# EasyEDA Pro project ProDoc_Board1_2_2024-09-12 (1).epro

# Schematic Schematic1_2
Create Date: 2024-07-28; Page Name: P1; Project Name: 四足机器人; Schematic Name: Schematic1_2; Update Date: 2024-07-28
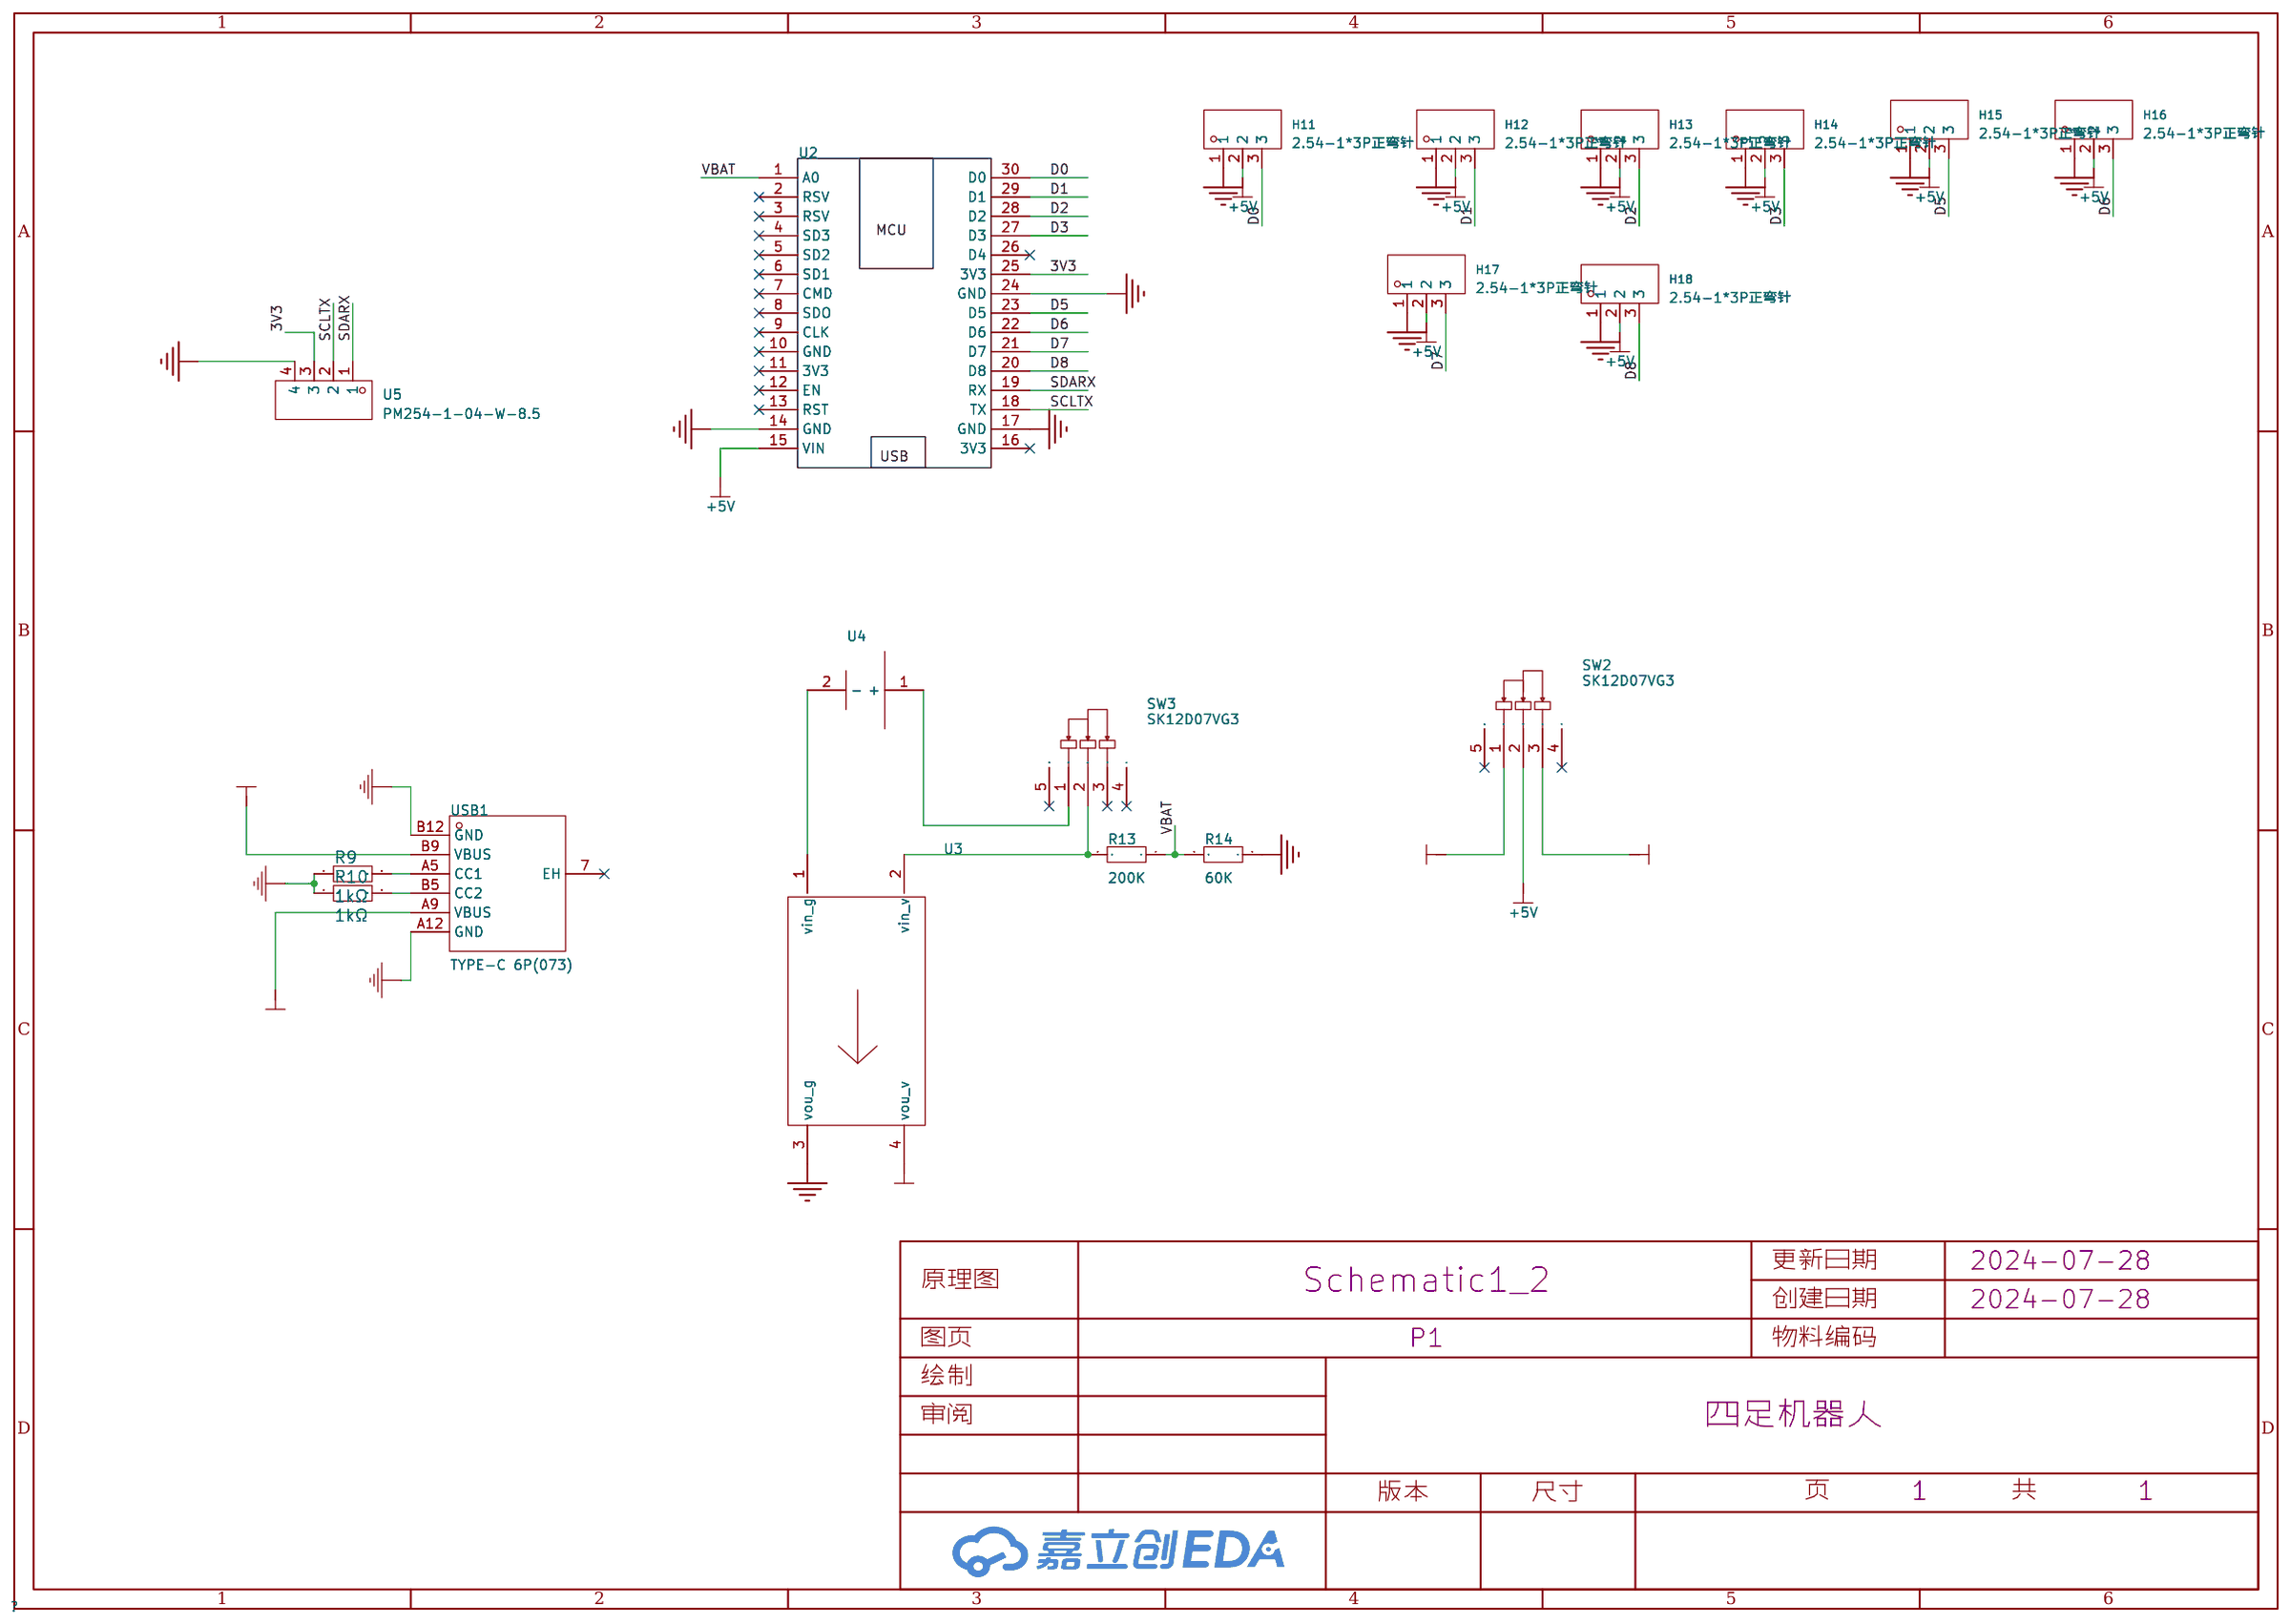
[diagram p0: schematic sheet]

## Parts
H11  2.54-1*3P正弯针  [HDR-TH_3P-P2.54-H-M-BW7.2-P]
H12  2.54-1*3P正弯针  [HDR-TH_3P-P2.54-H-M-BW7.2-P]
H13  2.54-1*3P正弯针  [HDR-TH_3P-P2.54-H-M-BW7.2-P]
H14  2.54-1*3P正弯针  [HDR-TH_3P-P2.54-H-M-BW7.2-P]
H15  2.54-1*3P正弯针  [HDR-TH_3P-P2.54-H-M-BW7.2-P]
H16  2.54-1*3P正弯针  [HDR-TH_3P-P2.54-H-M-BW7.2-P]
H17  2.54-1*3P正弯针  [HDR-TH_3P-P2.54-H-M-BW7.2-P]
H18  2.54-1*3P正弯针  [HDR-TH_3P-P2.54-H-M-BW7.2-P]
R9  1kΩ  [R0603]
R10  1kΩ  [R0603]
R13  200K  [R0603]
R14  60K  [R0603]
SW2  SK12D07VG3  [SW-TH_SK12D07VG3]
SW3  SK12D07VG3  [SW-TH_SK12D07VG3]
U2  -  [nodemcu]
U3  -  [5v5a降压模块]
U4  -  [7.4v]
U5  PM254-1-04-W-8.5  [HDR-TH_4P-P2.54-H-F-W10.0-N]
USB1  TYPE-C 6P(073)  [TYPE-C-SMD_TYPE-C-6P]

## Library data of the parts
H11-H18 = 2.54-1*3P正弯针: 插针结构:1x3P;间距:2.54mm;行距:-;圆针/方针:方针;安装类型:弯插;排数:单排;总PIN位数:3P;额定电流:3A;额定电压:-;配合针长度:3mm;塑高:2.54mm;端接针长度:-;触头材质:-;触头镀层:-;工作温度范围:-55℃~+105℃;颜色:黑色;; LCSC Part Name: 间距:2.54mm 1x3P 弯插 方针; Supplier Part: C92159; Manufacturer: BOOMELE(博穆精密); Supplier Footprint: 弯插,P=2.54mm; JLCPCB Part Class: 扩展库; Datasheet: https://atta.szlcsc.com/upload/public/pdf/source/20181121/C2334_B051029C4931EB562F9DCCAAD18AC88A.pdf; Supplier: LCSC; Pin Structure: 1x3P; Pitch: 2.54mm; Circluar Pins/Square Pins: 方针; Mounting Type: 弯插; Number of Rows: 单排; Number of Pins: 3P; Current Rating (Max): 3A; Length of Mating Pin: 3mm; Insulation Height: 2.54mm; Operating Temperature Range: -55℃~+105℃; Color: 黑色
R9 R10 R13 R14 = 0603WAF1002T5E: 阻值:10kΩ;精度:±1%;功率:100mW;温度系数:±100ppm/℃;电阻类型:厚膜电阻;; LCSC Part Name: 10kΩ ±1% 100mW 厚膜电阻; Supplier Part: C25804; Manufacturer: UNI-ROYAL(厚声); Supplier Footprint: 0603; JLCPCB Part Class: Basic Part; Datasheet: https://atta.szlcsc.com/upload/public/pdf/source/20200306/C422600_1E6D84923E4A46A82E41ADD87F860B5C.pdf; Supplier: LCSC; Tolerance: ±1%; Power(Watts): 100mW; Overload Voltage (Max): 75V; Temperature Coefficient: ±100ppm/℃; Type: 厚膜电阻; Operating Temperature Range: -55℃~+155℃
SW2 SW3 = SK12D07VG3: 电路结构:单刀双掷;安装方式:侧插;开关颜色:-;额定电流(DC):500mA;额定电压(DC):50V;额定电流(AC):-;额定电压(AC):-;机械寿命:5千次;; LCSC Part Name: 两档位卧式拨动开关,柄长3MM; Supplier Part: C431547; Manufacturer: SHOU HAN(首韩); Supplier Footprint: 插件; JLCPCB Part Class: 扩展库; Datasheet: https://atta.szlcsc.com/upload/public/pdf/source/20190925/C431547_01B93C6F3FA5C09E15F8CCBF4E6DB91A.pdf; Supplier: LCSC; Circuit: 单刀双掷; Pin Style: PC引脚; Switch Length: 8.7mm; Switch Width: 4.4mm; Switch Height: 4.7mm; Mounting Style: 侧插; Current Rating (DC): 500mA; Voltage Rating (DC): 50V; Mechanical Life: 5千次; Operating Temperature: -10℃~+50℃
U2 = nodemcu
U3 = 5v5a降压模块
U4 = 7.4电池输入口
U5 = PM254-1-04-W-8.5: 插孔结构:1x4P;间距:2.54mm;行距:-;圆孔/方孔:方孔;安装类型:弯插;排数:单排;总孔位数:4P;额定电流:3A;额定电压:-;插孔方向:侧面;塑高:8.5mm;触头材质:铜合金;工作温度范围:-40℃~+105℃;焊接温度(最大值):260℃@5S;; LCSC Part Name: 1x4P 间距:2.54mm 弯插; Supplier Part: C2897386; Manufacturer: HCTL(华灿天禄); Supplier Footprint: 弯插,P=2.54mm; JLCPCB Part Class: 扩展库; Datasheet: https://atta.szlcsc.com/upload/public/pdf/source/20230609/7BA40A3D721268A082DCDEAD4C99131B.pdf; Supplier: LCSC; Holes Structure: 1x4P; Pitch: 2.54mm; Circular Hole / Square Hole: 方孔; Mounting Type: 弯插; Number of Rows: 单排; Number of Holes: 4P; Current Rating (Max): 3A; Holes Direction: 侧面; Insulation Height: 8.5mm; Contact Material: 铜合金; Operating Temperature Range: -40℃~+105℃; Soldering Temperature(Max): 260℃@5S
USB1 = TYPE-C 6P(073): 连接器类型:Type-C;标准:-;公母:母;端口数量:1;触点数量:6P;安装方式:卧贴;额定电流 - 电源:5A;工作温度范围:-25℃~+85℃;; LCSC Part Name: Type-C 母 卧贴; Supplier Part: C668623; Manufacturer: SHOU HAN(首韩); Supplier Footprint: SMD; JLCPCB Part Class: 扩展库; Datasheet: https://atta.szlcsc.com/upload/public/pdf/source/20200618/C668623_A4B260DED7AC1949BAC6AE39E9F4CD80.pdf; Supplier: LCSC; Connector Type: Type-C; Gender: 母; Number of Ports: 1; Number of Contacts: 6P; Mounting Style: 卧贴; Current Rating - Power (Max): 5A; Operating Temperature Range: -25℃~+85℃

## Nets
3V3: U2.25(3V3) U5.3
+5V: H11.2 H12.2 H13.2 H14.2 H15.2 H16.2 H17.2 H18.2 SW2.2 U2.15(VIN)
GND: H11.1 H12.1 H13.1 H14.1 H15.1 H16.1 H17.1 H18.1 R9.1 R10.1 R14.1 U2.14(GND) U2.17(GND) U2.24(GND) U3.3(vou_g) U5.4 USB1.A12(GND) USB1.B12(GND)
VBAT: R13.1 R14.2 U2.1(A0)
D0: H11.3 U2.30(D0)
D1: H12.3 U2.29(D1)
D2: H13.3 U2.28(D2)
D3: H14.3 U2.27(D3)
D5: H15.3 U2.23(D5)
D6: H16.3 U2.22(D6)
D7: H17.3 U2.21(D7)
D8: H18.3 U2.20(D8)
SCLTX: U2.18(TX) U5.2
SDARX: U2.19(RX) U5.1
USB5V: SW2.1 USB1.A9(VBUS) USB1.B9(VBUS)
VBUCK5V: SW2.3 U3.4(vou_v)
$1N11422: R13.2 SW3.2 U3.2(vin_v)
$1N11765: R9.2 USB1.A5(CC1)
$1N11766: R10.2 USB1.B5(CC2)
Net-(SW3-1): SW3.1 U4.1(+)
Net-(U3-1): U3.1(vin_g) U4.2(-)

Not connected (* = marked no-connect by the designer): SW2 4* 5*; SW3 3* 4* 5*; U2 2(RSV)* 3(RSV)* 4(SD3)* 5(SD2)* 6(SD1)* 7(CMD)* 8(SDO)* 9(CLK)* 10(GND)* 11(3V3)* 12(EN)* 13(RST)* 16(3V3)* 26(D4)*; USB1 7(EH)*

# Board PCB1_2
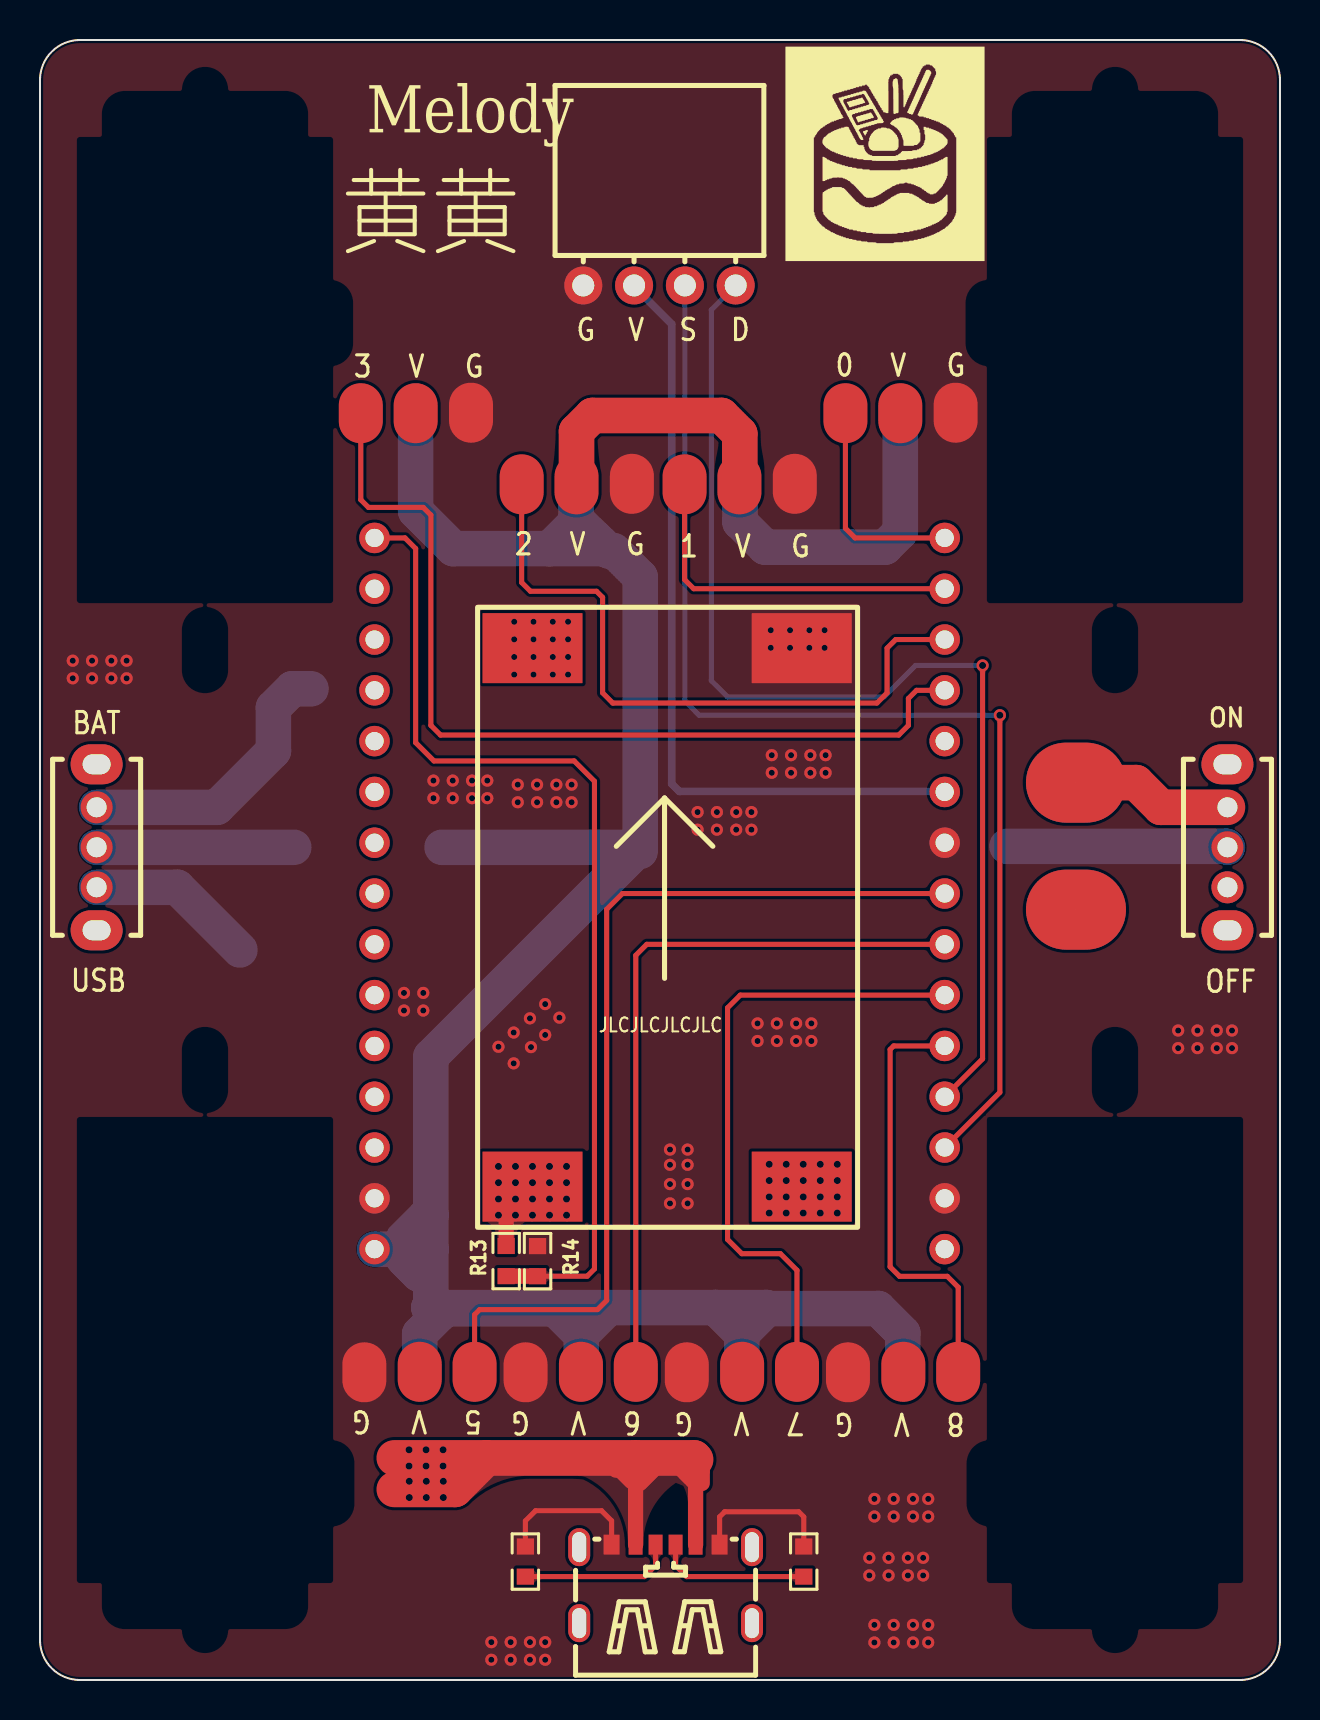
[diagram p1: board, top side]
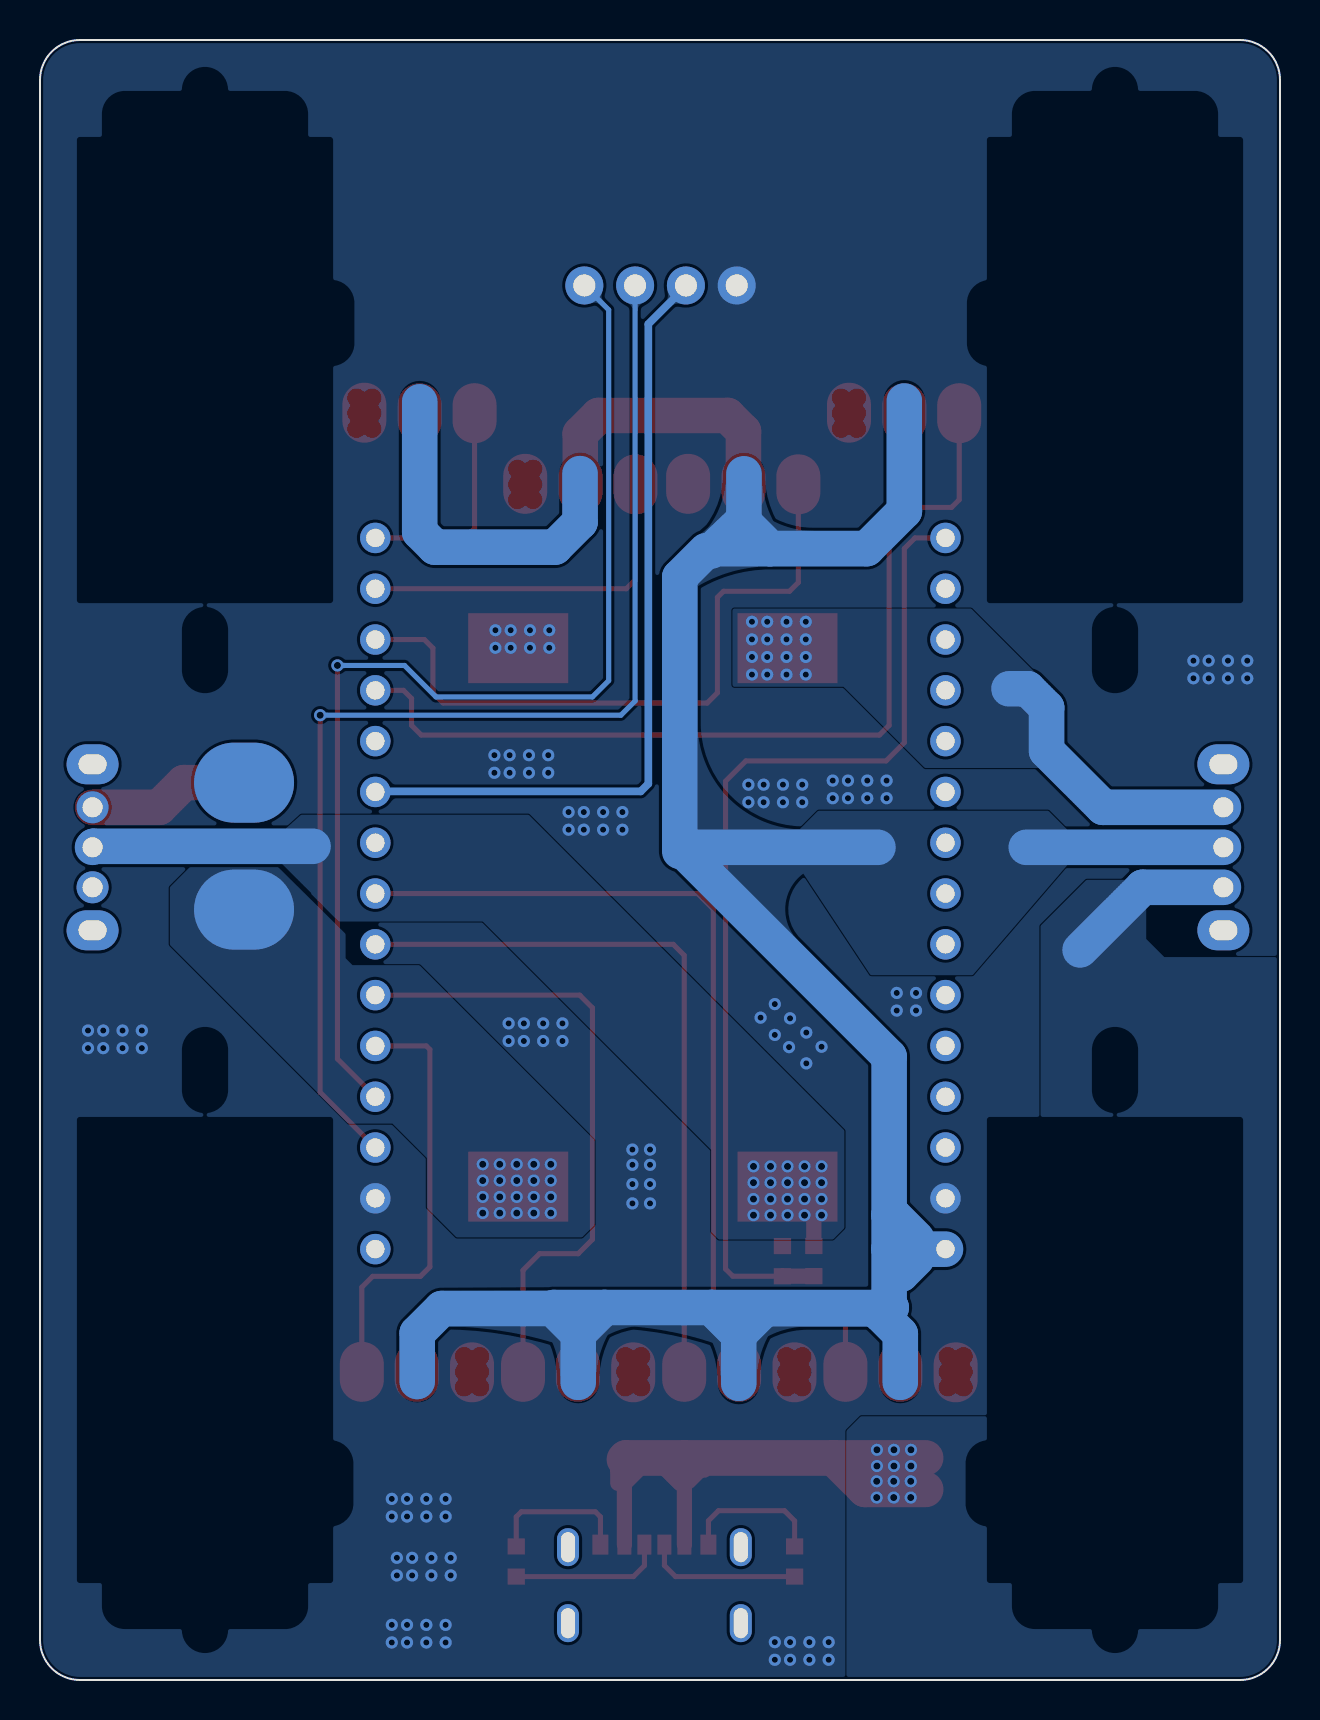
[diagram p2: board, bottom side, seen from below]

Outline 62 x 82 mm; copper layers: Top Layer, Bottom Layer. Coordinates in mm from the lower left corner of the outline.
Outline path: 0,80 0,2 arc(0.59,0.59) 2,0 60,0 arc(61.41,0.59) 62,2 62,80 arc(61.41,81.41) 60,82 2,82 arc(0.59,81.41) 0,80
Stack: Top Layer 0.035mm / Dielectric1 1.51mm FR4 er 4.5 / Bottom Layer 0.035mm

## Design rules (mm)
template: 自定义配置
spacing copperThickness1oz (default): track to track 0.102, other pairs 0 to 0.3
spacing copperThickness2oz: track to track 0.203, other pairs 0.152 to 0.3
track width copperThickness1oz (default): min 0.127, default 0.254, max 2.54
track width copperThickness2oz: min 0.203, default 0.254, max 2.54
differential pair differentialPair (default): width min 0.127, default 0.254, max 2.54; gap min 0.152, default 0.152
via viaSize (default): diameter min 0.5, default 0.61, max 10; hole min 0.3, default 0.305, max 6.299

## Placement (name value [footprint] x y rotation side)
H11  2.54-1*3P正弯针  [HDR-TH_3P-P2.54-H-M-BW7.2-P]  43.01 60.33 180 top
H12  2.54-1*3P正弯针  [HDR-TH_3P-P2.54-H-M-BW7.2-P]  34.97 56.77 180 top
H13  2.54-1*3P正弯针  [HDR-TH_3P-P2.54-H-M-BW7.2-P]  26.83 56.77 180 top
H14  2.54-1*3P正弯针  [HDR-TH_3P-P2.54-H-M-BW7.2-P]  18.78 60.33 180 top
H15  2.54-1*3P正弯针  [HDR-TH_3P-P2.54-H-M-BW7.2-P]  18.99 18.42 0 top
H16  2.54-1*3P正弯针  [HDR-TH_3P-P2.54-H-M-BW7.2-P]  27.05 18.42 0 top
H17  2.54-1*3P正弯针  [HDR-TH_3P-P2.54-H-M-BW7.2-P]  35.11 18.42 0 top
H18  2.54-1*3P正弯针  [HDR-TH_3P-P2.54-H-M-BW7.2-P]  43.17 18.42 0 top
ON  -  [7.4v]  63.1 91.35 270 top
R9  1kΩ  [R0603]  24.27 5.92 270 top
R10  1kΩ  [R0603]  38.19 5.92 270 top
R13  200K  [R0603]  23.31 20.95 90 top
R14  60K  [R0603]  24.88 20.94 270 top
SW2  SK12D07VG3  [SW-TH_SK12D07VG3]  2.83 41.64 90 top
SW3  SK12D07VG3  [SW-TH_SK12D07VG3]  59.37 41.64 270 top
U2  -  [nodemcu]  15.48 67.9 0 top
U3  -  [5v5a降压模块]  40.88 22.64 180 top
U5  PM254-1-04-W-8.5  [HDR-TH_4P-P2.54-H-F-W10.0-N]  30.97 69.73 180 top
USB1  TYPE-C 6P(073)  [TYPE-C-SMD_TYPE-C-6P]  31.28 4.81 0 top

## Footprints (pads in the part's own frame, mm; a bottom-side part is the same pattern mirrored in y, then rotated)
5v5a降压模块
  custom 5x3.5 smd: 1(2.794,-2.032) 2(16.256,-2.032) 3(2.794,-28.956) 4(16.256,-28.956)
7.4v
  oval 4x5 hole 0.003: 1(46.482,-11.303) 2(52.832,-11.303)
HDR-TH_3P-P2.54-H-M-BW7.2-P
  oval 2.2x3 smd: 1(-2.768,-3.035) 2(0,-3.01) 3(2.743,-3.01)
HDR-TH_4P-P2.54-H-F-W10.0-N
  round 1.9 hole 1.1: 1(-3.81,0) 2(-1.27,0) 3(1.27,0) 4(3.81,0)
nodemcu
  round 1.524 hole 0.914: 1(1.246,-10.795) 2(1.246,-13.335) 3(1.246,-15.875) 4(1.246,-18.415) 5(1.246,-20.955) 6(1.246,-23.495) 7(1.246,-26.035) 8(1.246,-28.575) 9(1.246,-31.115) 10(1.246,-33.655) 11(1.246,-36.195) 12(1.246,-38.735) 13(1.246,-41.275) 14(1.246,-43.815) 15(1.246,-46.355) 16(29.754,-46.355) 17(29.754,-43.815) 18(29.754,-41.275) 19(29.754,-38.735) 20(29.754,-36.195) 21(29.754,-33.655) 22(29.754,-31.115) 23(29.754,-28.575) 24(29.754,-26.035) 25(29.754,-23.495) 26(29.754,-20.955) 27(29.754,-18.415) 28(29.754,-15.875) 29(29.754,-13.335) 30(29.754,-10.795)
R0603
  rect 0.806x0.864 smd: 1(-0.753,0) 2(0.753,0)
SW-TH_SK12D07VG3
  oval 1.6x1.6 hole 1: 1(-2,0) 2(0,0) 3(2,0)
  oval 2x2.6 hole 1x1.4: 4(4.15,0) 5(-4.15,0)
TYPE-C-SMD_TYPE-C-6P
  oval 1.1x1.9 hole 0.7x1.5: 7(-4.32,1.837) 7(-4.32,-1.962) 7(4.32,1.837) 7(4.32,-1.962)
  rect 0.7x1 smd: A5(-0.5,1.962) A9(1.5,1.962) B5(0.5,1.962) B9(-1.5,1.962)
  rect 0.8x1 smd: A12(2.7,1.962) B12(-2.7,1.962)

## Nets
As in the schematic, except:
$1N10514: ON.2 U3.1
$1N10734: ON.1 SW3.1

Pads without a net: SW2 4 5; SW3 3 4 5; U2 2 3 4 5 6 7 8 9 10 11 12 13 16 26; USB1 7

## Via types
v1: diameter 0.61, hole 0.305, Top Layer to Bottom Layer, 132 vias
v2: diameter 0.61, hole 0.355, Top Layer to Bottom Layer, 54 vias

## Routing (per net, layer and track width the routed paths; a pad name or vN(x,y) marks a point on that pad's centre or on a via; arc(x,y) is an arc through that point)
3V3: length 39.4
  Bottom Layer w0.381: 45.1,44.48 45.05,44.43 31.97,44.43 31.58,44.81 31.58,67.8 29.65,69.73
+5V: length 174.9
  Top Layer w1.778: H13.2 26.83,62.43 27.62,63.23 34.07,63.23 34.99,62.31 34.99,59.85 34.97,59.83 H12.2
  Bottom Layer w1.778: 28.37,18.56 28.43,18.62 ; 28.37,18.56 25.75,18.56 ; 28.37,18.56 27.06,17.25 ; 28.43,18.62 19.65,18.62 ; 28.43,18.62 33.77,18.62 ; 19.65,18.62 19.98,18.29 ; 19.65,18.62 19.44,18.62 19.54,18.73 ; 19.65,18.62 19.54,18.73 ; U2.15 19.54,21.54 ; 19.54,21.54 19.54,18.73 ; 19.54,21.54 19.54,23.25 ; 30.01,41.64 30.01,41.43 ; 30.01,41.64 19.54,31.17 19.54,23.25 ; 30.01,41.64 30.01,55.15 28.69,56.47 ; 30.01,41.64 20.1,41.64 ; 25.75,18.56 20.24,18.56 19.98,18.29 ; 25.75,18.56 27.06,17.25 ; 19.98,18.29 18.99,17.3 18.99,14.88 ; 26.8,58.03 28.32,56.57 ; 26.8,58.03 26.8,57.89 25.48,56.57 ; 26.8,58.03 26.8,60.31 ; 28.32,56.57 25.48,56.57 ; 28.32,56.57 28.32,56.57 28.44,56.45 28.32,56.57 ; 25.48,56.57 20.66,56.57 18.78,58.45 18.78,63.95 ; 33.77,18.62 35.09,17.3 ; 33.77,18.62 36.31,18.62 36.36,18.57 ; 19.09,20.3 18.94,20.3 18.17,21.06 ; SW2.2 12.69,41.64 ; 35,60.32 35,57.9 36.26,56.64 42.25,56.64 43.01,57.41 43.01,63.91 ; 36.36,18.57 41.91,18.57 43.14,17.34 43.14,14.92 ; 36.36,18.57 35.09,17.3 ; 27.06,17.25 27.06,14.83 ; 19.54,23.25 19.35,23.25 18.17,22.08 ; 35.09,17.3 35.09,14.88
GND: length 14.5
  Top Layer w0.254: R10.1 38.19,8.16 37.93,8.41 34.23,8.41 33.98,8.16 USB1.A12 ; USB1.B12 28.58,7.96 28.08,8.46 24.78,8.46 24.27,7.95 R9.1
  vias: v1(1.64,50.97) v1(1.64,50.08) v1(2.6,50.97) v1(2.6,50.08) v1(3.57,50.97) v1(3.57,50.08) v1(4.33,50.97) v1(4.33,50.08) v1(18.2,34.35) v1(18.2,33.47) v1(19.16,34.35) v1(19.16,33.47) v1(19.67,44.97) v1(19.67,44.09) v1(20.64,44.97) v1(20.64,44.09) v1(21.6,44.97) v1(21.6,44.09) v1(22.36,44.97) v1(22.36,44.09) v1(22.57,1.89) v1(22.57,1.01) v1(22.92,31.66) v1(23.53,1.89) v1(23.53,1.01) v1(23.69,32.37) v1(23.69,30.83) v1(23.89,44.77) v1(23.89,43.89) v1(24.5,33.08) v1(24.55,31.64) v1(24.5,1.89) v1(24.5,1.01) v1(24.85,44.77) v1(24.85,43.89) v1(25.26,33.8) v1(25.26,32.25) v1(25.26,1.89) v1(25.26,1.01) v1(25.82,44.77) v1(25.82,43.89) v1(25.97,33.12) v1(26.58,44.77) v1(26.58,43.89) v1(31.5,26.52) v1(31.5,25.76) v1(31.5,24.8) v1(31.5,23.83) v1(32.38,26.52) v1(32.38,25.76) v1(32.38,24.8) v1(32.38,23.83) v1(32.88,43.4) v1(32.88,42.52) v1(33.84,43.4) v1(33.84,42.52) v1(34.81,43.4) v1(34.81,42.52) v1(35.57,43.4) v1(35.57,42.52) v1(35.88,32.83) v1(35.88,31.95) v1(36.54,52.49) v1(36.54,51.61) v1(36.59,46.24) v1(36.59,45.36) v1(36.84,32.83) v1(36.84,31.95) v1(37.5,52.49) v1(37.5,51.61) v1(37.55,46.24) v1(37.55,45.36) v1(37.81,32.83) v1(37.81,31.95) v1(38.47,52.49) v1(38.47,51.61) v1(38.52,46.24) v1(38.52,45.36) v1(38.57,32.83) v1(38.57,31.95) v1(39.23,52.49) v1(39.23,51.61) v1(39.28,46.24) v1(39.28,45.36) v1(41.47,6.11) v1(41.47,5.23) v1(41.72,9.06) v1(41.72,8.17) v1(41.72,2.76) v1(41.72,1.88) v1(42.43,6.11) v1(42.43,5.23) v1(42.68,9.06) v1(42.68,8.17) v1(42.68,2.76) v1(42.68,1.88) v1(43.4,6.11) v1(43.4,5.23) v1(43.65,9.06) v1(43.65,8.17) v1(43.65,2.76) v1(43.65,1.88) v1(44.16,6.11) v1(44.16,5.23) v1(44.41,9.06) v1(44.41,8.17) v1(44.41,2.76) v1(44.41,1.88) v1(56.91,32.47) v1(56.91,31.59) v1(57.87,32.47) v1(57.87,31.59) v1(58.84,32.47) v1(58.84,31.59) v1(59.6,32.47) v1(59.6,31.59)
VBAT: length 50.7
  Top Layer w0.254: R14.2 27.36,20.19 27.72,20.55 27.72,44.94 26.71,45.95 19.7,45.95 18.78,46.87 18.78,56.57 18.25,57.1 U2.1
  Top Layer w0.762: R13.1 24.87,20.19 R14.2
D0: length 10.9
  Top Layer w0.254: H11.3 40.27,57.59 40.75,57.1 U2.30
D1: length 18
  Top Layer w0.254: 32.23,59.78 32.23,55.02 32.69,54.56 U2.29
D2: length 34
  Top Layer w0.254: U2.28 42.79,52.02 42.35,51.59 42.35,49.36 41.85,48.85 28.64,48.85 28.13,49.36 28.13,54.13 27.82,54.44 24.52,54.44 24.08,54.88 H13.3
D3: length 46.3
  Top Layer w0.254: U2.27 43.83,49.48 43.42,49.08 43.42,47.73 42.94,47.25 20.03,47.25 19.54,47.73 19.54,58.25 19.16,58.63 16.42,58.63 16.04,59.01 H14.3
D5: length 46.5
  Top Layer w0.254: H15.3 21.73,18.27 21.98,18.52 27.88,18.52 28.33,18.98 28.33,38.54 29.12,39.32 U2.23
D6: length 36.5
  Top Layer w0.254: U2.22 30.34,36.78 29.79,36.23 H16.3
D7: length 31.9
  Top Layer w0.254: H17.3 37.85,20.49 37.02,21.32 35.09,21.32 34.38,22.03 34.38,33.61 35.01,34.24 U2.21
D8: length 21.7
  Top Layer w0.254: H18.3 45.91,19.64 45.36,20.18 42.98,20.18 42.51,20.65 42.51,31.53 42.68,31.7 U2.20
SCLTX: length 59.6
  Top Layer w0.254: v2(47.99,48.24) 47.99,29.38 U2.18
  Bottom Layer w0.254: U5.2 32.24,48.95 32.96,48.24 v2(47.99,48.24)
SDARX: length 57.2
  Top Layer w0.254: U2.19 47.13,31.06 v2(47.13,50.73)
  Bottom Layer w0.254: U5.1 33.57,68.51 33.57,49.97 34.38,49.15 42.2,49.15 43.78,50.73 v2(47.13,50.73)
USB5V: length 41.7
  Top Layer w0.762: 29.55,9.94 28.99,10.49 28.79,10.49 ; 32.78,9.81 USB1.A9 ; 32.78,9.81 32.78,10.75 ; 32.78,9.81 31.99,10.6 ; 32.78,10.75 32.78,11.03 ; 32.78,10.75 33.11,10.42 33.11,9.83 ; USB1.B9 29.78,11.1 ; 30.72,10.65 30.72,10.55 30.01,9.83
  Top Layer w1.778: 22.32,11.1 17.72,11.1 ; 22.32,11.1 32.7,11.1 32.78,11.03 ; 22.32,11.1 20.75,9.53 17.72,9.53
  Bottom Layer w1.778: SW2.1 6.86,39.64 9.99,36.5
  vias: v2(18.45,11.51) v2(18.45,10.7) v2(18.46,9.94) v2(18.46,9.12) v2(19.3,11.51) v2(19.3,10.7) v2(19.31,9.94) v2(19.31,9.12) v2(20.15,11.51) v2(20.15,10.7) v2(20.17,9.94) v2(20.17,9.12)
VBUCK5V: length 14.4
  Bottom Layer w1.778: SW2.3 8.84,43.64 11.67,46.46 11.67,48.62 12.61,49.56 13.55,49.56
  vias: v1(23.71,52.91) v1(23.71,52.03) v1(23.71,51.15) v1(23.71,50.27) v1(24.68,52.91) v1(24.68,52.03) v1(24.68,51.15) v1(24.68,50.27) v1(25.64,52.91) v1(25.64,52.03) v1(25.64,51.15) v1(25.64,50.27) v1(26.4,52.91) v1(26.4,52.03) v1(26.4,51.15) v1(26.4,50.27)
$1N10514: length 1
  Bottom Layer w0.254: 52.22,38.52 52.22,37.5
  vias: v2(36.46,25.79) v2(36.46,24.97) v2(36.46,24.15) v2(36.46,23.35) v2(37.31,25.79) v2(37.31,24.97) v2(37.31,24.15) v2(37.31,23.35) v2(38.16,25.79) v2(38.16,24.97) v2(38.16,24.15) v2(38.16,23.35) v2(39.01,25.79) v2(39.01,24.97) v2(39.01,24.15) v2(39.01,23.35) v2(39.86,25.79) v2(39.86,24.97) v2(39.86,24.15) v2(39.86,23.35)
$1N10734: length 8.1
  Top Layer w0.508: ON.1 53.07,44.87
  Top Layer w1.778: SW3.1 56.04,43.64 54.81,44.87 53.07,44.87
$1N11422: length 14.6
  Top Layer w0.762: U3.2 23.31,23.35 R13.2
  Bottom Layer w1.778: 48.35,41.69 59.32,41.69 SW3.2
  vias: v2(22.92,25.68) v2(22.92,24.87) v2(22.92,24.05) v2(22.92,23.24) v2(23.77,25.68) v2(23.77,24.87) v2(23.77,24.05) v2(23.77,23.24) v2(24.62,25.68) v2(24.62,24.87) v2(24.62,24.05) v2(24.62,23.24) v2(25.48,25.68) v2(25.48,24.87) v2(25.48,24.05) v2(25.48,23.24) v2(26.33,25.68) v2(26.33,24.87) v2(26.33,24.05) v2(26.33,23.24)
$1N11765: length 7.8
  Top Layer w0.254: USB1.A5 30.78,5.73 30.22,5.17 R9.2
$1N11766: length 7.7
  Top Layer w0.254: USB1.B5 31.78,5.72 32.33,5.17 R10.2

## Copper pours and planes (outline as drawn; the poured copper is in the pictures)
+5V on Bottom Layer: 11.62,43.36 23.05,43.36 24.66,41.75 20.42,35.34 15.41,35.34 9.95,41.69
GND on Top Layer: -10.07,88.98 74.61,88.98 74.61,-13.84 -10.07,-13.84
GND on Bottom Layer: -15.61,91.42 82.59,91.42 82.59,-21.05 -15.61,-21.05
USB5V on Bottom Layer: 11.87,13.09 20.92,13.09 21.58,12.43 21.58,-0.17 20.05,-1.7 -2.15,-1.7 -4.18,0.33 -4.18,34.37 -2.5,36.05 5.83,36.05 6.79,37.01 6.79,39.7 7,39.91 9.64,39.91 11.87,37.67
VBUCK5V on Bottom Layer: 12.33,50.32 15.48,53.47 27.28,53.47 27.28,49.76 21.78,49.76 17.72,45.7 11.4,45.7 11.15,45.95 11.15,46.96 12.33,48.14
$1N10514 on Bottom Layer: 50.21,40.62 54.39,40.62 55.41,39.6 55.41,36.8 46.53,27.92 44.34,27.92 42.56,26.14 42.56,23.65 41.13,22.23 34.94,22.23 34.38,22.79 34.38,26.95 43.06,35.64 46.42,35.64 46.82,36.05 46.82,37.27
$1N11422 on Bottom Layer: 21.88,22.64 21.88,27.44 37.61,43.16 48.91,43.16 49.92,42.24 49.92,41.18 50.02,41.08 48.35,39.4 48.35,39.35 47.03,38.03 39.82,38.03 28.33,26.54 28.33,22.43 28.03,22.13 22.39,22.13

Small or netless copper shapes (teardrops, artwork), in the pictures only: 24 on Top Layer, 17 on Bottom Layer

## Text on the board
Top Silkscreen Layer: JLCJLCJLCJLC | USB | BAT | 3 | V | G | 2 | S | 1 | D | 0 | OFF | 5 | 6 | 7 | 8 | Melody | 黄黄
